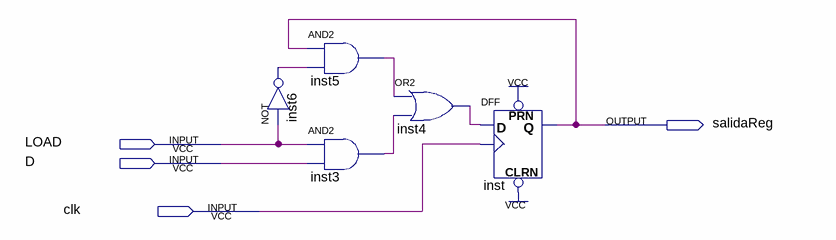
[diagram p0: schematic sheet]
// Quartus schematic bitRegistro.bdf as structural Verilog: 5 symbols, 4 pins
module bitRegistro (
  input  LOAD,
  input  D,
  input  clk,
  output salidaReg
);

  wire inst3_out, inst4_out, inst5_out, inst6_out;

  not inst6 (inst6_out, LOAD);
  and inst5 (inst5_out, salidaReg, inst6_out);
  and inst3 (inst3_out, LOAD, D);
  or inst4 (inst4_out, inst5_out, inst3_out);
  DFF inst (.CLRN(1'b1), .CLK(clk), .D(inst4_out), .PRN(1'b1), .Q(salidaReg));
endmodule
